# Altium schematic sheet RPL_POWER.SchDoc
size A
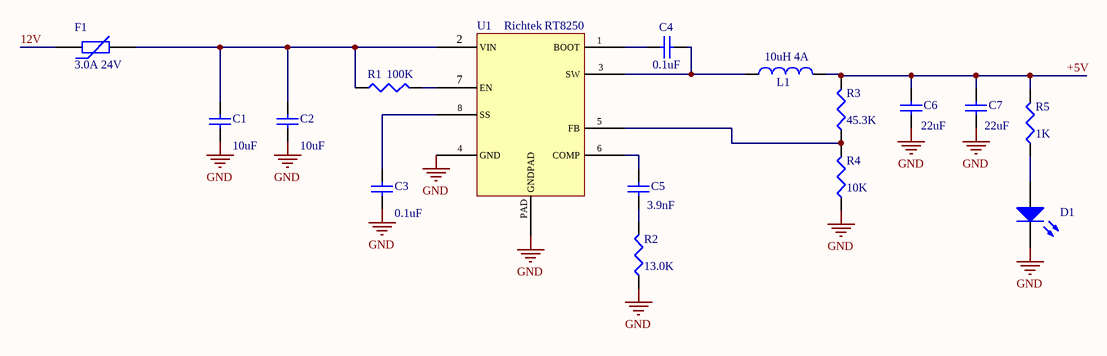
[diagram p0: RPL_POWER.SchDoc]

## Parts
C1  value 10uF  [C1206]  (hidden comment: Cap Semi)
C2  value 10uF  [C1206]  (hidden comment: Cap Semi)
C3  value 0.1uF  [C1206]  (hidden comment: Cap Semi)
C4  value 0.1uF  [C1206]  (hidden comment: Cap Semi)
C5  value 3.9nF  [C1206]  (hidden comment: Cap Semi)
C6  value 22uF  [C1206]  (hidden comment: Cap Semi)
C7  value 22uF  [C1206]  (hidden comment: Cap Semi)
D1  LED2  [3.2X1.6X1.1]  (value not drawn)
F1  3.0A 24V  [6-0805_N]
L1  value 10uH 4A  [0402-A]  (hidden comment: Inductor)
R1  value 100K  [J1-0603]  (hidden comment: Res3)
R2  value 13.0K  [J1-0603]  (hidden comment: Res3)
R3  value 45.3K  [J1-0603]  (hidden comment: Res3)
R4  value 10K  [J1-0603]  (hidden comment: Res3)
R5  value 1K  [J1-0603]  (hidden comment: Res3)
U1  Manufacturer: Richtek  (hidden comment: RT8250GSP)

## Nets
GND: C1.1 C2.1 C3.1 C6.1 C7.1 D1.2(K) R2.1 R4.1 U1.4(GND) U1.PAD(GNDPAD)
12V: F1.1
+5V: C6.2 C7.2 L1.2 R3.2 R5.2
NetC1_2: C1.2 C2.2 F1.2 R1.1 U1.2(VIN)
NetC3_2: C3.2 U1.8(SS)
NetC4_1: C4.1 U1.1(BOOT)
NetC4_2: C4.2 L1.1 U1.3(SW)
NetC5_1: C5.1 R2.2
NetC5_2: C5.2 U1.6(COMP)
NetD1_1: D1.1(A) R5.1
NetR1_2: R1.2 U1.7(EN)
NetR3_1: R3.1 R4.2 U1.5(FB)

## Library data of the parts
C1-C7 = Cap Semi: Capacitor (Semiconductor SIM Model); Published: 8-Jun-2000; LatestRevisionDate: 29-May-2009; LatestRevisionNote: IPC-7351 Footprint Added.; PackageReference: C1206; Publisher: Altium Limited; PackageDescription: Chip Capacitor
D1 = LED2: Typical RED, GREEN, YELLOW, AMBER GaAs LED; Published: 8-Jun-2000; LatestRevisionDate: 17-Jul-2002; LatestRevisionNote: Re-released for DXP Platform.; PackageVersion: Feb-2002; PackageReference: 3.2X1.6X1.1; Publisher: Altium Limited; PackageDescription: SM LED; 2 Flat Leads
F1 = Res Varistor: Varistor (Voltage-Sensitive Resistor); Published: 24-Mar-1999; LatestRevisionDate: 29-May-2009; LatestRevisionNote: IPC-7351 Footprint Added.; PackageVersion: Mar-2003; PackageReference: 6-0805; Publisher: Altium Limited; PackageDescription: Chip Resistor 0805 Case Size; Code_IPC: RESC2012
L1 = Inductor: Code_IEC: 1005; Published: 8-Jun-2000; LatestRevisionDate: 29-May-2009; LatestRevisionNote: IPC-7351 Footprint Added.; PackageReference: 0402-A; Publisher: Altium Limited; PackageDescription: Chip Inductor; Code_JEITA: 0402
R1-R5 = Res3: Resistor; Published: 8-Jun-2000; LatestRevisionDate: 29-May-2009; LatestRevisionNote: IPC-7351 Footprint Added.; PackageReference: J1-0603; Publisher: Altium Limited; PackageDescription: Chip Resistor
U1 = RT8250: Buck Switching Regulator IC Positive Adjustable 0.925V 1 Output 3A 8-SOIC (0.154", 3.90mm Width) Exposed Pad; Manufacturer Part Number: RT8250